# Altium schematic sheet MCORD_Hub.SchDoc: MCORD_HUB
size 420 x 297 mm; Author: G.Kasprowicz; CompanyName: WUT ISE; DrawnBy: G.Kasprowicz; Organization: WUT ISE; Address1: PW ISE; Address2: Nowowiejska 15/19 00-665 Warsaw; Address3: gkasprow@gmail.com; DocumentNumber: 1; Revision: 2; SheetNumber: 1; SheetTotal: 6; ModifiedBy: -; CheckedDate: -; Title2: Top; DivGrp: WUT ISE; Designer: G.Kasprowicz; ModifiedDate: -; ProjectName: Sensor Box
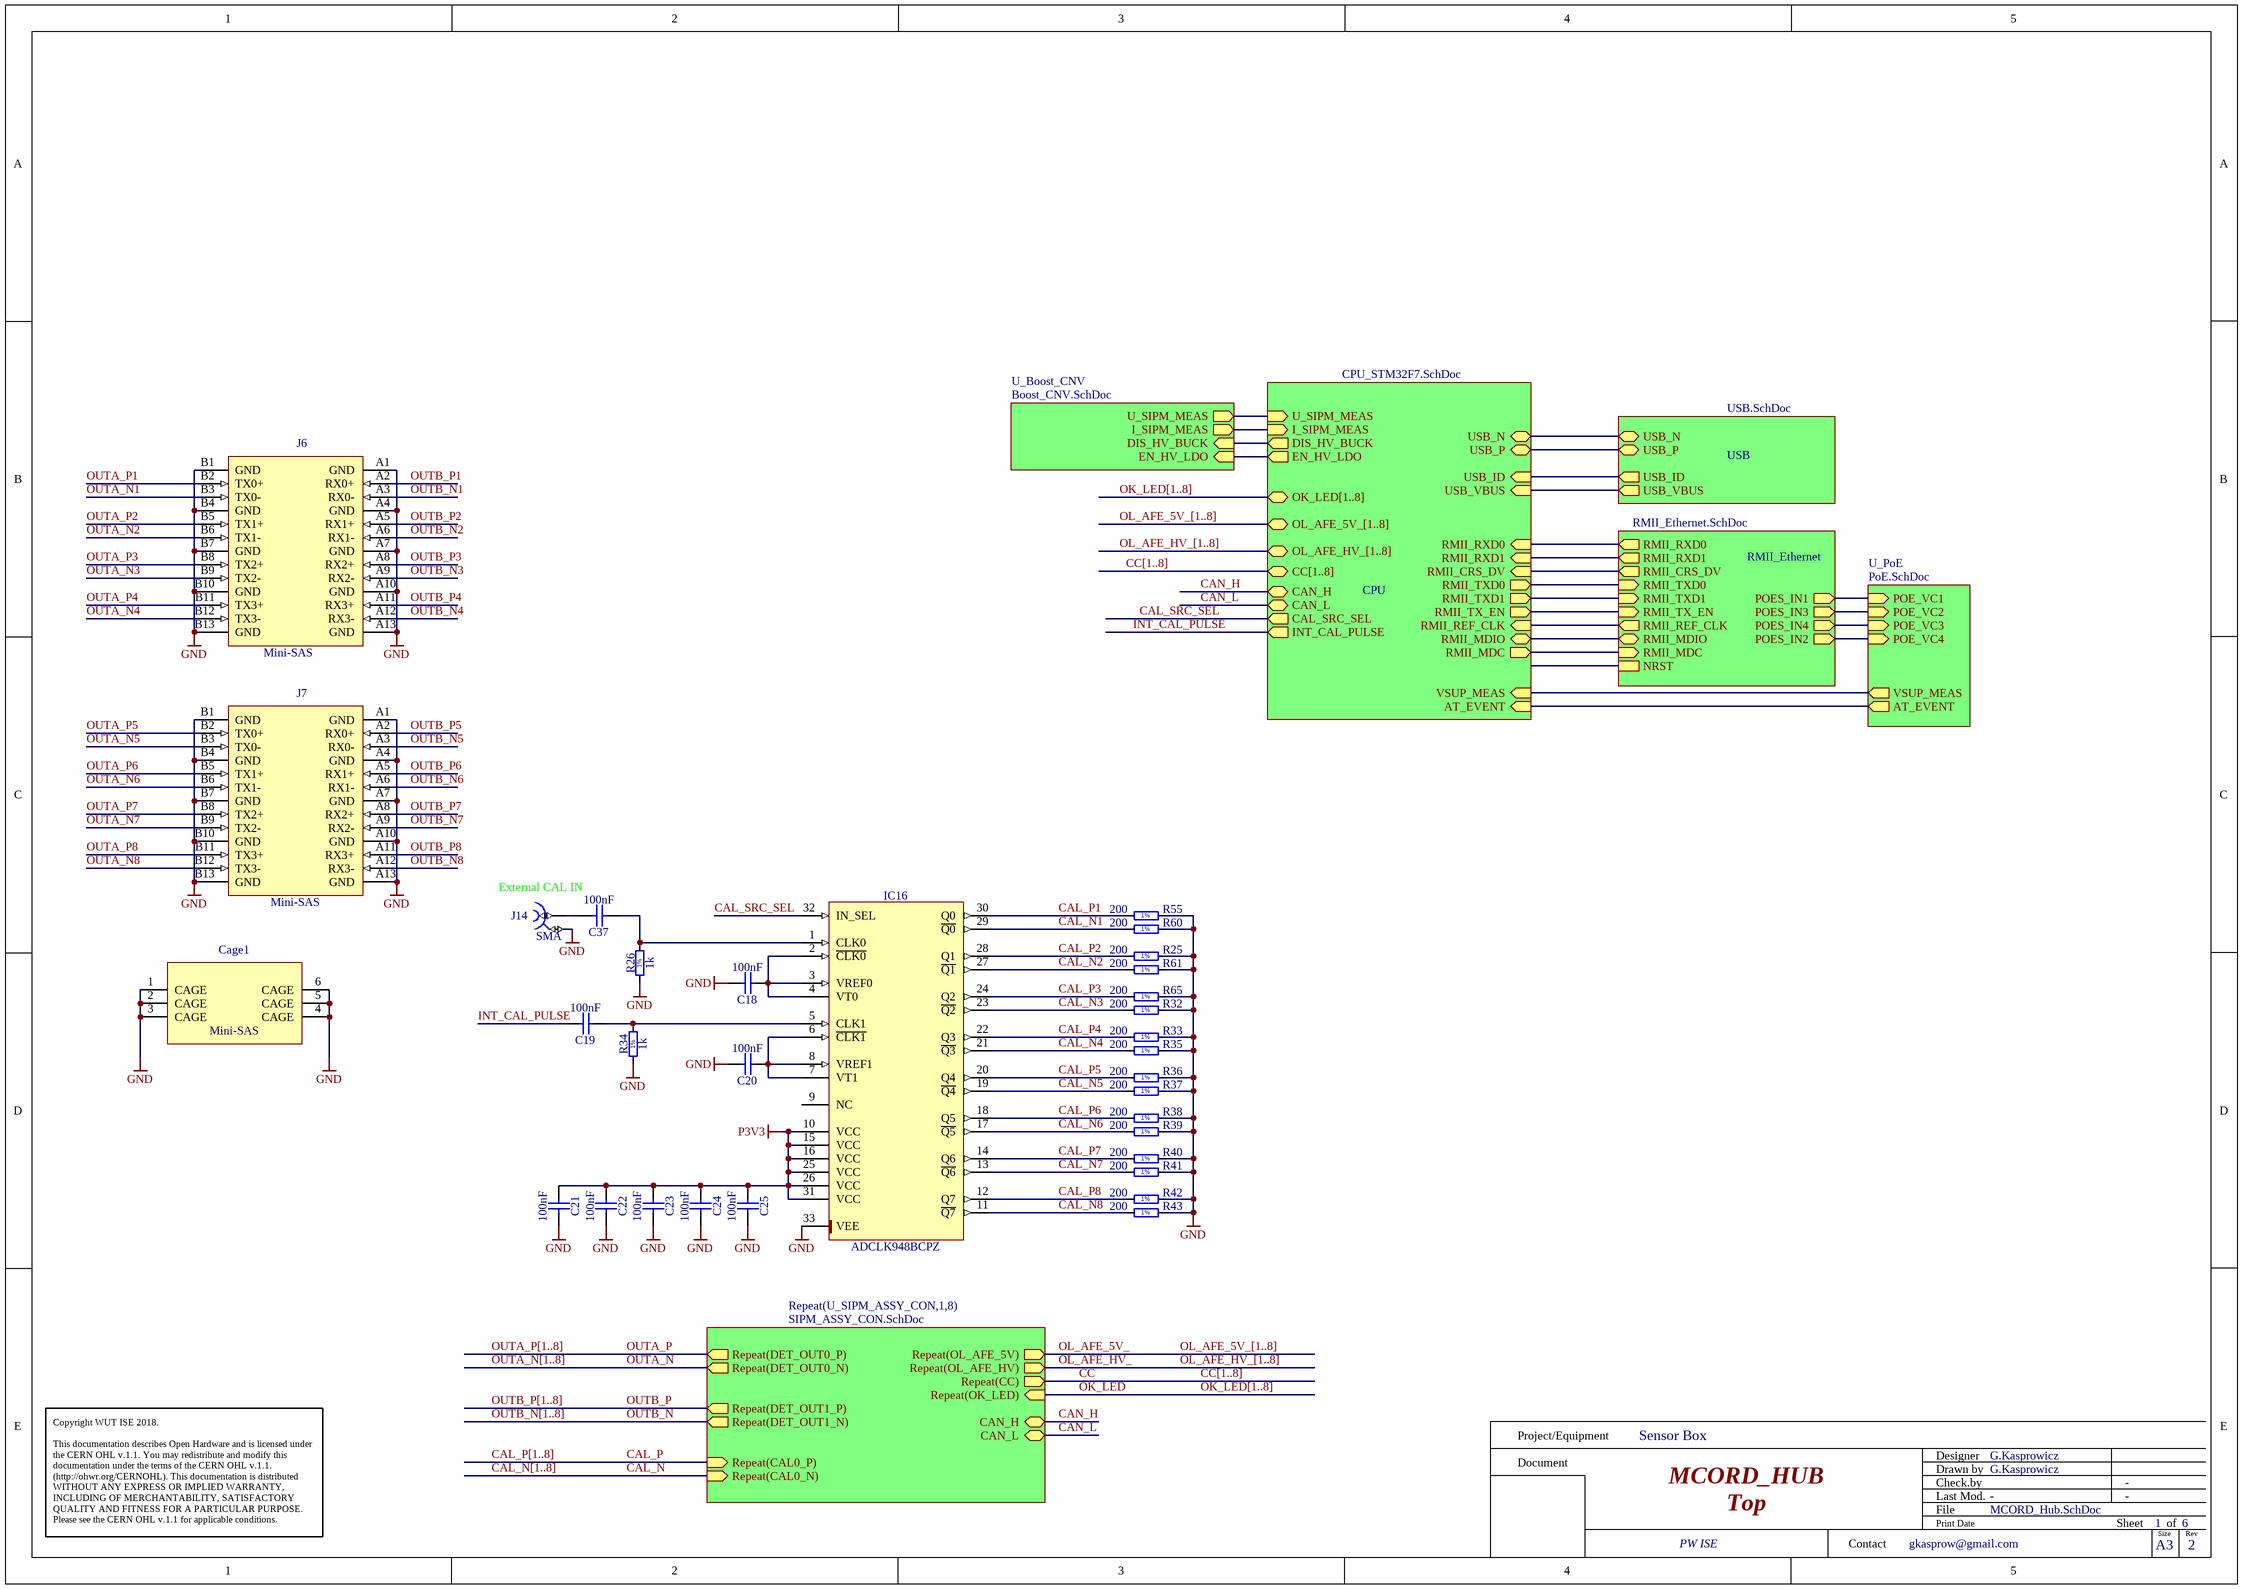
[diagram p0: MCORD_Hub.SchDoc]

## Parts
C18  100nF  [CAPC1005X55N]
C19  100nF  [CAPC1005X55N]
C20  100nF  [CAPC1005X55N]
C21  100nF  [CAPC1005X55N]
C22  100nF  [CAPC1005X55N]
C23  100nF  [CAPC1005X55N]
C24  100nF  [CAPC1005X55N]
C25  100nF  [CAPC1005X55N]
C37  100nF  [CAPC1005X55N]
Cage1  Mini-SAS  [TYCO_1888321-2]
IC16  ADCLK948BCPZ  [QFN50P500X500X80-33N-S285]
J6  Mini-SAS  [TYCO_1761987-7]
J7  Mini-SAS  [TYCO_1761987-7]
J14  SMA  [RF249BT0050GHDW]
R25  200  [RESC1005X40N]
R26  1k  [RESC1005X40N]
R32  200  [RESC1005X40N]
R33  200  [RESC1005X40N]
R34  1k  [RESC1005X40N]
R35  200  [RESC1005X40N]
R36  200  [RESC1005X40N]
R37  200  [RESC1005X40N]
R38  200  [RESC1005X40N]
R39  200  [RESC1005X40N]
R40  200  [RESC1005X40N]
R41  200  [RESC1005X40N]
R42  200  [RESC1005X40N]
R43  200  [RESC1005X40N]
R55  200  [RESC1005X40N]
R60  200  [RESC1005X40N]
R61  200  [RESC1005X40N]
R65  200  [RESC1005X40N]

## Sub-sheets
CPU = CPU_STM32F7.SchDoc: USB_N (bidir), USB_P (bidir), USB_ID (in), USB_VBUS (in), RMII_TXD0 (out), RMII_TX_EN (out), RMII_RXD0 (in), RMII_REF_CLK (in), RMII_CRS_DV (in), RMII_MDC (out), RMII_MDIO (bidir), RMII_TXD1 (out), RMII_RXD1 (in), U_SIPM_MEAS (in), I_SIPM_MEAS (in), DIS_HV_BUCK (out), EN_HV_LDO (out), CC[1..8] (bidir), CAN_H (bidir), CAN_L (bidir), CAL_SRC_SEL (out), INT_CAL_PULSE (out), OL_AFE_HV_[1..8] (bidir), OL_AFE_5V_[1..8] (bidir), OK_LED[1..8] (bidir), AT_EVENT (in), VSUP_MEAS (in)
Repeat(U_SIPM_ASSY_CON,1,8) = SIPM_ASSY_CON.SchDoc: Repeat(CAL0_N) (in), Repeat(DET_OUT1_N) (out), Repeat(DET_OUT0_N) (out), Repeat(DET_OUT1_P) (out), Repeat(CAL0_P) (in), CAN_H (bidir), Repeat(DET_OUT0_P) (out), CAN_L (bidir), Repeat(CC) (out), Repeat(OL_AFE_HV) (out), Repeat(OL_AFE_5V) (out), Repeat(OK_LED) (in)
RMII_Ethernet = RMII_Ethernet.SchDoc: RMII_TXD0 (in), RMII_TX_EN (in), RMII_RXD0 (out), RMII_REF_CLK (out), RMII_CRS_DV (out), RMII_MDC (in), RMII_MDIO (bidir), NRST, RMII_TXD1 (in), RMII_RXD1 (out), POES_IN1 (out), POES_IN3 (out), POES_IN4 (out), POES_IN2 (out)
U_Boost_CNV = Boost_CNV.SchDoc: U_SIPM_MEAS (out), I_SIPM_MEAS (out), EN_HV_LDO (in), DIS_HV_BUCK (in)
U_PoE = PoE.SchDoc: POE_VC1 (in), POE_VC2 (in), POE_VC3 (in), POE_VC4 (in), AT_EVENT (out), VSUP_MEAS (out)
USB = USB.SchDoc: USB_N (bidir), USB_P (bidir), USB_ID (out), USB_VBUS (out)

## Nets
GND: C18.2 C20.2 C21.2 C22.2 C23.2 C24.2 C25.2 Cage1.1(CAGE) Cage1.2(CAGE) Cage1.3(CAGE) Cage1.4(CAGE) Cage1.5(CAGE) Cage1.6(CAGE) IC16.33(VEE) J6.A1(GND) J6.A4(GND) J6.A7(GND) J6.A10(GND) J6.A13(GND) J6.B1(GND) J6.B4(GND) J6.B7(GND) J6.B10(GND) J6.B13(GND) J7.A1(GND) J7.A4(GND) J7.A7(GND) J7.A10(GND) J7.A13(GND) J7.B1(GND) J7.B4(GND) J7.B7(GND) J7.B10(GND) J7.B13(GND) J14.2 R25.2 R26.1 R32.2 R33.2 R34.1 R35.2 R36.2 R37.2 R38.2 R39.2 R40.2 R41.2 R42.2 R43.2 R55.2 R60.2 R61.2 R65.2
P3V3: C21.1 C22.1 C23.1 C24.1 C25.1 IC16.10(VCC) IC16.15(VCC) IC16.16(VCC) IC16.25(VCC) IC16.26(VCC) IC16.31(VCC)
CAL_N: sheet Repeat(U_SIPM_ASSY_CON,1,8)/Repeat(CAL0_N)
CAL_N1: IC16.29(~{Q0}) R60.1
CAL_N2: IC16.27(~{Q1}) R61.1
CAL_N3: IC16.23(~{Q2}) R32.1
CAL_N4: IC16.21(~{Q3}) R35.1
CAL_N5: IC16.19(~{Q4}) R37.1
CAL_N6: IC16.17(~{Q5}) R39.1
CAL_N7: IC16.13(~{Q6}) R41.1
CAL_N8: IC16.11(~{Q7}) R43.1
CAL_P: sheet Repeat(U_SIPM_ASSY_CON,1,8)/Repeat(CAL0_P)
CAL_P1: IC16.30(Q0) R55.1
CAL_P2: IC16.28(Q1) R25.1
CAL_P3: IC16.24(Q2) R65.1
CAL_P4: IC16.22(Q3) R33.1
CAL_P5: IC16.20(Q4) R36.1
CAL_P6: IC16.18(Q5) R38.1
CAL_P7: IC16.14(Q6) R40.1
CAL_P8: IC16.12(Q7) R42.1
CAL_SRC_SEL: IC16.32(IN_SEL) ; sheet CPU/CAL_SRC_SEL
CAN_H: sheet Repeat(U_SIPM_ASSY_CON,1,8)/CAN_H, sheet CPU/CAN_H
CAN_L: sheet Repeat(U_SIPM_ASSY_CON,1,8)/CAN_L, sheet CPU/CAN_L
CC: sheet Repeat(U_SIPM_ASSY_CON,1,8)/Repeat(CC)
INT_CAL_PULSE: C19.2 ; sheet CPU/INT_CAL_PULSE
OK_LED: sheet Repeat(U_SIPM_ASSY_CON,1,8)/Repeat(OK_LED)
OL_AFE_5V_: sheet Repeat(U_SIPM_ASSY_CON,1,8)/Repeat(OL_AFE_5V)  [also labelled OL_AFE_5V_[1..8]]
OL_AFE_HV_: sheet Repeat(U_SIPM_ASSY_CON,1,8)/Repeat(OL_AFE_HV)  [also labelled OL_AFE_HV_[1..8]]
OUTA_N: sheet Repeat(U_SIPM_ASSY_CON,1,8)/Repeat(DET_OUT0_N)
OUTA_N1: J6.B3(TX0-)
OUTA_N2: J6.B6(TX1-)
OUTA_N3: J6.B9(TX2-)
OUTA_N4: J6.B12(TX3-)
OUTA_N5: J7.B3(TX0-)
OUTA_N6: J7.B6(TX1-)
OUTA_N7: J7.B9(TX2-)
OUTA_N8: J7.B12(TX3-)
OUTA_P: sheet Repeat(U_SIPM_ASSY_CON,1,8)/Repeat(DET_OUT0_P)
OUTA_P1: J6.B2(TX0+)
OUTA_P2: J6.B5(TX1+)
OUTA_P3: J6.B8(TX2+)
OUTA_P4: J6.B11(TX3+)
OUTA_P5: J7.B2(TX0+)
OUTA_P6: J7.B5(TX1+)
OUTA_P7: J7.B8(TX2+)
OUTA_P8: J7.B11(TX3+)
OUTB_N: sheet Repeat(U_SIPM_ASSY_CON,1,8)/Repeat(DET_OUT1_N)
OUTB_N1: J6.A3(RX0-)
OUTB_N2: J6.A6(RX1-)
OUTB_N3: J6.A9(RX2-)
OUTB_N4: J6.A12(RX3-)
OUTB_N5: J7.A3(RX0-)
OUTB_N6: J7.A6(RX1-)
OUTB_N7: J7.A9(RX2-)
OUTB_N8: J7.A12(RX3-)
OUTB_P: sheet Repeat(U_SIPM_ASSY_CON,1,8)/Repeat(DET_OUT1_P)
OUTB_P1: J6.A2(RX0+)
OUTB_P2: J6.A5(RX1+)
OUTB_P3: J6.A8(RX2+)
OUTB_P4: J6.A11(RX3+)
OUTB_P5: J7.A2(RX0+)
OUTB_P6: J7.A5(RX1+)
OUTB_P7: J7.A8(RX2+)
OUTB_P8: J7.A11(RX3+)
NetC18_1: C18.1 IC16.2(~{CLK0}) IC16.3(VREF0) IC16.4(VT0)
NetC19_1: C19.1 IC16.5(CLK1) R34.2
NetC20_1: C20.1 IC16.6(~{CLK1}) IC16.7(VT1) IC16.8(VREF1)
NetC37_1: C37.1 IC16.1(CLK0) R26.2
NetC37_2: C37.2 J14.1
(unnamed): sheet U_Boost_CNV/U_SIPM_MEAS, sheet CPU/U_SIPM_MEAS
(unnamed): sheet U_Boost_CNV/I_SIPM_MEAS, sheet CPU/I_SIPM_MEAS
(unnamed): sheet U_Boost_CNV/EN_HV_LDO, sheet CPU/EN_HV_LDO
(unnamed): sheet U_Boost_CNV/DIS_HV_BUCK, sheet CPU/DIS_HV_BUCK
(unnamed): sheet RMII_Ethernet/RMII_TXD0, sheet CPU/RMII_TXD0
(unnamed): sheet RMII_Ethernet/RMII_TX_EN, sheet CPU/RMII_TX_EN
(unnamed): sheet RMII_Ethernet/RMII_RXD0, sheet CPU/RMII_RXD0
(unnamed): sheet RMII_Ethernet/RMII_REF_CLK, sheet CPU/RMII_REF_CLK
(unnamed): sheet RMII_Ethernet/RMII_CRS_DV, sheet CPU/RMII_CRS_DV
(unnamed): sheet RMII_Ethernet/RMII_MDC, sheet CPU/RMII_MDC
(unnamed): sheet RMII_Ethernet/RMII_MDIO, sheet CPU/RMII_MDIO
(unnamed): sheet RMII_Ethernet/RMII_TXD1, sheet CPU/RMII_TXD1
(unnamed): sheet RMII_Ethernet/RMII_RXD1, sheet CPU/RMII_RXD1
(unnamed): sheet RMII_Ethernet/POES_IN1, sheet U_PoE/POE_VC1
(unnamed): sheet RMII_Ethernet/POES_IN3, sheet U_PoE/POE_VC2
(unnamed): sheet RMII_Ethernet/POES_IN4, sheet U_PoE/POE_VC3
(unnamed): sheet RMII_Ethernet/POES_IN2, sheet U_PoE/POE_VC4
(unnamed): sheet USB/USB_N, sheet CPU/USB_N
(unnamed): sheet USB/USB_P, sheet CPU/USB_P
(unnamed): sheet USB/USB_ID, sheet CPU/USB_ID
(unnamed): sheet USB/USB_VBUS, sheet CPU/USB_VBUS
(unnamed): sheet CPU/AT_EVENT, sheet U_PoE/AT_EVENT
(unnamed): sheet CPU/VSUP_MEAS, sheet U_PoE/VSUP_MEAS

Not connected (* = marked no-connect by the designer): IC16 9(NC)

## Buses and harness runs
bus CAL_N[1..8]
bus CAL_P[1..8]
bus CC[1..8]
bus CC[1..8] = sheet CPU/CC[1..8]
bus OK_LED[1..8]
bus OK_LED[1..8] = sheet CPU/OK_LED[1..8]
bus OL_AFE_5V_[1..8] = sheet CPU/OL_AFE_5V_[1..8]
bus OL_AFE_HV_[1..8] = sheet CPU/OL_AFE_HV_[1..8]
bus OUTA_N[1..8]
bus OUTA_P[1..8]
bus OUTB_N[1..8]
bus OUTB_P[1..8]

## Notes on the sheet
- External CAL IN
- Project/Equipment
- Document
- Designer
- Drawn by
- Check.by
- Copyright WUT ISE 2018.
  This documentation describes Open Hardware and is licensed under the CERN OHL v.1.1. You may redistribute and modify this documentation under the terms of the CERN OHL v.1.1. (http://ohwr.org/CERNOHL). This documentation is distributed WITHOUT ANY EXPRESS OR IMPLIED WARRANTY, INCLUDING OF MERCHANTABILITY, SATISFACTORY QUALITY AND FITNESS FOR A PARTICULAR PURPOSE. Please see the CERN OHL v.1.1 for applicable conditions.
- Contact
- File
- Last Mod.
- Print Date
- Sheet
- Size
- A3
- of
- Rev
- (in symbol R0402_1K_1%_0.0625W_100PPM) 1%
- (in symbol R0402_200R_1%_0.0625W_100PPM) 1%

## Library data of the parts
C18-C25 C37 = CC0402_100NF_16V_10%_X7R: Non-polarised capacitor; Part Description: SMD Multilayer Chip Ceramic Capacitor; Manufacturer: GENERIC; Manufacturer1 Part Number: GRM155R71C104KA88D; Voltage: 16V; TC: X7R; Tolerance: ±10%; Part Number: CC0402_100NF_16V_10%_X7R; Component Kind: Standard; Component Type: Standard; Pin Count: 2; Value: 100nF; Status: Not Recommended; Manufacturer Part Number: CC0402_100NF_16V_10%_X7R; Case: 0402; Mounted: Yes; Socket: No; SMD: Yes; Manufacturer1 Example: MURATA; Manufacturer1 ComponentHeight: 0.55mm; HelpURL: \\cern.ch\dfs\Applications\Altium\Datasheets\CC0402_X7R_MURATA_GRM.pdf; Author: CERN DEM JLC; CreateDate: 05.12.2013; LatestRevisionDate: 03.12.2007; Sense: No
Cage1 = TYCO_1888321-2: Mini-SAS Cage (6Pins); Part Description: Through Hole Dual Port EVERCLEAR Mini-SAS Cage; Manufacturer: TYCO ELECTRONICS; PressFit: No; Part Number: TYCO_1888321-2; Component Kind: Standard; Component Type: Standard; Pin Count: 10; Family: Mini-SAS; Mounted: Yes; Socket: No; SMD: No; Sense: No; Status: None; Manufacturer Part Number: 1888321-2; ComponentHeight: 8.63mm; HelpURL: \\cern.ch\dfs\Applications\Altium\Datasheets\TYCO_1888321-2.pdf; Author: CERN DEM BC; CreateDate: 04.04.2019; LatestRevisionDate: 04.04.2019
IC16 = ADCLK948BCPZ: Two Selectable Inputs, 8 LVPECL Outputs, SiGe Clock Fanout Buffer; Manufacturer: ANALOG DEVICES; PressFit: No; Bonding: No; Part Number: ADCLK948BCPZ; Component Kind: Standard; Component Type: Standard; Device: ADCLK948BCPZ; PackageDescription: QFN, 0.50mm Pitch, Square; 8 Pin X 8 Pin, 5mm X 5mm X 1.00mm H body (w/thermal tab 2.85 X 2.85mm),  IPC Medium Density; Part Description: Two Selectable Inputs, 8 LVPECL Outputs, SiGe Clock Fanout Buffer; Manufacturer Part Number: ADCLK948BCPZ; Pin Count: 33; Case: QFN32; Mounted: Yes; Socket: No; SMD: Yes; Sense: No; ComponentHeight: 0.8mm; Author: CERN DEM MR; HelpURL: \\cern.ch\dfs\Applications\Altium\Datasheets\ADCLK948BCPZ.pdf; CreateDate: 30.11.2016; LatestRevisionDate: 30.11.2016
J6 J7 = TYCO_1761987-7: 26 Position Mini-Sas Connector (Quad Small Form-Factor SFF-8088); Part Description: Surface Mount EVERCLEAR Mini-SAS Right Angle Receptacle (Quad Small Form-Factor SFF-8088); Manufacturer: TYCO ELECTRONICS; PressFit: No; Part Number: TYCO_1761987-7; Component Kind: Standard; Component Type: Standard; Pin Count: 26; Family: Mini-SAS; Mounted: Yes; Socket: No; SMD: Yes; Sense: No; Status: None; Manufacturer Part Number: 1761987-7; ComponentHeight: 5.55mm; HelpURL: \\cern.ch\dfs\Applications\Altium\Datasheets\TYCO_1761987-7.pdf; Author: CERN DEM MR; CreateDate: 24.04.2019; LatestRevisionDate: 24.04.2019
J14 = CON_SMA_RF249BT0050GHDW: 50 Ohm Through Hole SMA Right Angle PCB Jack; Part Number: AdamTech_RF249BT0050GHDW; Manufacturer: AdamTech / Molex; Manufacturer Part Number: RF249BT0050GHDW / 0732512201; PressFit: No; Component Kind: Standard; Component Type: Standard; Pin Count: 5; Family: SMA; Mounted: Yes; Socket: No; SMD: No; Sense: No; Status: None; Part Description: 50 Ohm Through Hole SMA Right Angle PCB Jack; ComponentHeight: 10.44mm; HelpURL: \\cern.ch\dfs\Applications\Altium\Datasheets\AMPHENOL_132203.pdf; Author: GK; CreateDate: 06.10.2016; LatestRevisionDate: 06.10.2016
R25 R32 R33 R35-R43 R55 R60 R61 R65 = R0402_200R_1%_0.0625W_100PPM: Resistor - 1%; Part Description: General Purpose Thick Film Chip Resistor; Manufacturer: GENERIC; Manufacturer1 Part Number: 232270672001L; TC: ±100ppm/°C; PressFit: No; Part Number: R0402_200R_1%_0.0625W_100PPM; Component Kind: Standard; Component Type: Standard; Pin Count: 2; Value: 200; Status: Not Recommended; Power: 0.0625W; Tolerance: ±1%; Manufacturer Part Number: R0402_200R_1%_0.0625W_100PPM; Case: 0402; Mounted: Yes; Sense: No; Socket: No; SMD: Yes; Manufacturer1 Example: YAGEO PHYCOMP; Manufacturer1 ComponentHeight: 0.4mm; HelpURL: \\cern.ch\dfs\Applications\Altium\Datasheets\R0402_Phycomp_RC0402.pdf; Author: CERN DEM JLC; CreateDate: 03.12.2007; LatestRevisionDate: 17.10.2012
R26 R34 = R0402_1K_1%_0.0625W_100PPM: Resistor - 1%; Part Description: General Purpose Thick Film Chip Resistor; Manufacturer: GENERIC; Manufacturer1 Part Number: 232270671002L; TC: ±100ppm/°C; PressFit: No; Part Number: R0402_1K_1%_0.0625W_100PPM; Component Kind: Standard; Component Type: Standard; Pin Count: 2; Value: 1k; Status: Not Recommended; Power: 0.0625W; Tolerance: ±1%; Manufacturer Part Number: R0402_1K_1%_0.0625W_100PPM; Case: 0402; Mounted: Yes; Sense: No; Socket: No; SMD: Yes; Manufacturer1 Example: YAGEO PHYCOMP; Manufacturer1 ComponentHeight: 0.4mm; HelpURL: \\cern.ch\dfs\Applications\Altium\Datasheets\R0402_Phycomp_RC0402.pdf; Author: CERN DEM JLC; CreateDate: 03.12.2007; LatestRevisionDate: 17.10.2012